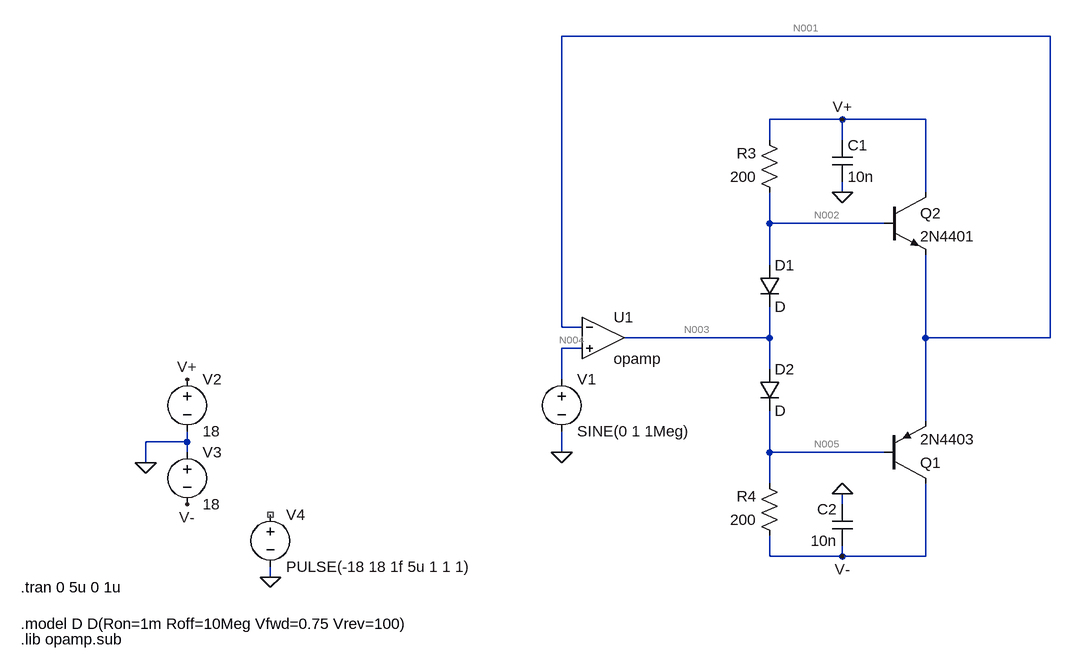
[diagram p0: schematic buffer.asc]
buffer.asc, the LTspice schematic file:
Version 4
SHEET 1 1320 700
WIRE 560 -304 -192 -304
WIRE 240 -176 128 -176
WIRE 368 -176 240 -176
WIRE 128 -144 128 -176
WIRE 240 -144 240 -176
WIRE 240 -64 240 -80
WIRE 368 -64 368 -176
WIRE 128 -16 128 -64
WIRE 304 -16 128 -16
WIRE 128 48 128 -16
WIRE -192 144 -192 -304
WIRE -160 144 -192 144
WIRE 128 160 128 112
WIRE 128 160 -96 160
WIRE 368 160 368 32
WIRE 560 160 560 -304
WIRE 560 160 368 160
WIRE -160 176 -192 176
WIRE 128 208 128 160
WIRE -192 224 -192 176
WIRE 368 288 368 160
WIRE -768 320 -768 304
WIRE -768 320 -832 320
WIRE -768 336 -768 320
WIRE -192 336 -192 304
WIRE 128 336 128 272
WIRE 304 336 128 336
WIRE -832 352 -832 320
WIRE 128 384 128 336
WIRE 240 416 240 400
WIRE 128 496 128 464
WIRE 240 496 240 480
WIRE 240 496 128 496
WIRE 368 496 368 384
WIRE 368 496 240 496
WIRE -640 528 -640 512
FLAG 240 -176 V+
FLAG 240 496 V-
FLAG -192 336 0
FLAG -832 352 0
FLAG -768 416 V-
FLAG -768 224 V+
FLAG -640 528 0
FLAG 240 -64 0
FLAG 240 400 0
SYMBOL OpAmps\\opamp -128 96 R0
SYMATTR InstName U1
SYMBOL voltage -192 208 R0
WINDOW 123 0 0 Left 0
WINDOW 39 0 0 Left 0
SYMATTR InstName V1
SYMATTR Value SINE(0 1 1Meg)
SYMBOL voltage -768 208 R0
WINDOW 123 0 0 Left 0
WINDOW 39 0 0 Left 0
SYMATTR InstName V2
SYMATTR Value 18
SYMBOL voltage -768 320 R0
WINDOW 123 0 0 Left 0
WINDOW 39 0 0 Left 0
SYMATTR InstName V3
SYMATTR Value 18
SYMBOL res 144 -48 R180
WINDOW 0 36 76 Left 2
WINDOW 3 36 40 Left 2
SYMATTR InstName R3
SYMATTR Value 200
SYMBOL res 144 480 R180
WINDOW 0 36 76 Left 2
WINDOW 3 36 40 Left 2
SYMATTR InstName R4
SYMATTR Value 200
SYMBOL npn 304 -64 R0
SYMATTR InstName Q2
SYMATTR Value 2N4401
SYMBOL voltage -640 416 R0
WINDOW 123 0 0 Left 0
WINDOW 39 0 0 Left 0
SYMATTR InstName V4
SYMATTR Value PULSE(-18 18 1f 5u 1 1 1)
SYMBOL pnp 304 384 M180
SYMATTR InstName Q1
SYMATTR Value 2N4403
SYMBOL diode 112 48 R0
SYMATTR InstName D1
SYMBOL diode 112 208 R0
SYMATTR InstName D2
SYMBOL cap 224 -144 R0
SYMATTR InstName C1
SYMATTR Value 10n
SYMBOL cap 256 480 R180
WINDOW 0 24 56 Left 2
WINDOW 3 24 8 Left 2
SYMATTR InstName C2
SYMATTR Value 10n
TEXT -1024 544 Left 2 !.tran 0 5u 0 1u
TEXT -1024 600 Left 2 !.model D D(Ron=1m Roff=10Meg Vfwd=0.75 Vrev=100)
TEXT -1024 624 Left 2 !.lib opamp.sub

The netlist it stands for:
* buffer.asc
XU1 N001 N004 N003 opamp Aol=100K GBW=10Meg  ; pins invin noninvin out
V1 N004 0 SINE(0 1 1Meg)
V2 V+ 0 18
V3 0 V- 18
R3 N002 V+ 200
R4 V- N005 200
Q2 V+ N002 N001 0 2N4401
V4 NC_01 0 PULSE(-18 18 1f 5u 1 1 1)
Q1 V- N005 N001 0 2N4403
D1 N002 N003 D
D2 N003 N005 D
C1 V+ 0 10n
C2 V- 0 10n
.model D D
.lib standard.dio
.model NPN NPN
.model PNP PNP
.lib standard.bjt
.tran 0 5u 0 1u
.model D D(Ron=1m Roff=10Meg Vfwd=0.75 Vrev=100)
.lib opamp.sub
.backanno
.end

* Results of the author's LTspice run, read from the files saved beside the schematic
* Operating Point, zero values left out:
*   V(n003) = -47.43 mV
*   V(n001) = 478.9 nV
*   V(v+) = 18 V
*   V(v-) = -18 V
*   V(n002) = 702.7 mV
*   V(n005) = -797.5 mV
*   Ic(Q1) = -17.62 mA
*   Ib(Q1) = -73.17 µA
*   Ie(Q1) = 17.69 mA
*   Ic(Q2) = 17.61 mA
*   Ib(Q2) = 81.08 µA
*   Ie(Q2) = -17.69 mA
*   I(D2) = 85.94 mA
*   I(D1) = 86.41 mA
*   I(R4) = -86.01 mA
*   I(R3) = -86.49 mA
*   I(V3) = -103.6 mA
*   I(V2) = -104.1 mA
*   Ix(u1:3) = 466.4 µA
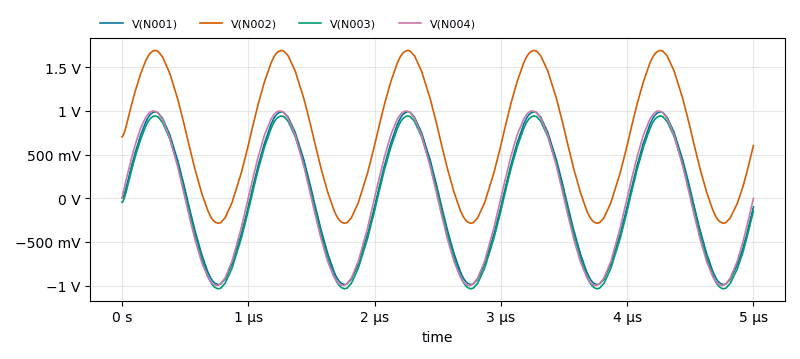
[diagram p1: Transient Analysis of buffer.asc, plotted from the saved traces]
* Transient Analysis, 1 run:
*   V(N001): min -989.6 mV, max 990.4 mV, average 553.3 µV, rms 693.8 mV, last -100.1 mV
*   V(N002): min -287.2 mV, max 1.693 V, average 703.2 mV, rms 988 mV, last 602.8 mV
*   V(N003): min -1.037 V, max 943.2 mV, average -46.87 mV, rms 695.5 mV, last -147.3 mV
*   V(N004): min -998 mV, max 998.9 mV, average 99.46 µV, rms 709.1 mV, last 0 V